# Altium schematic sheet Power.SchDoc
size A4
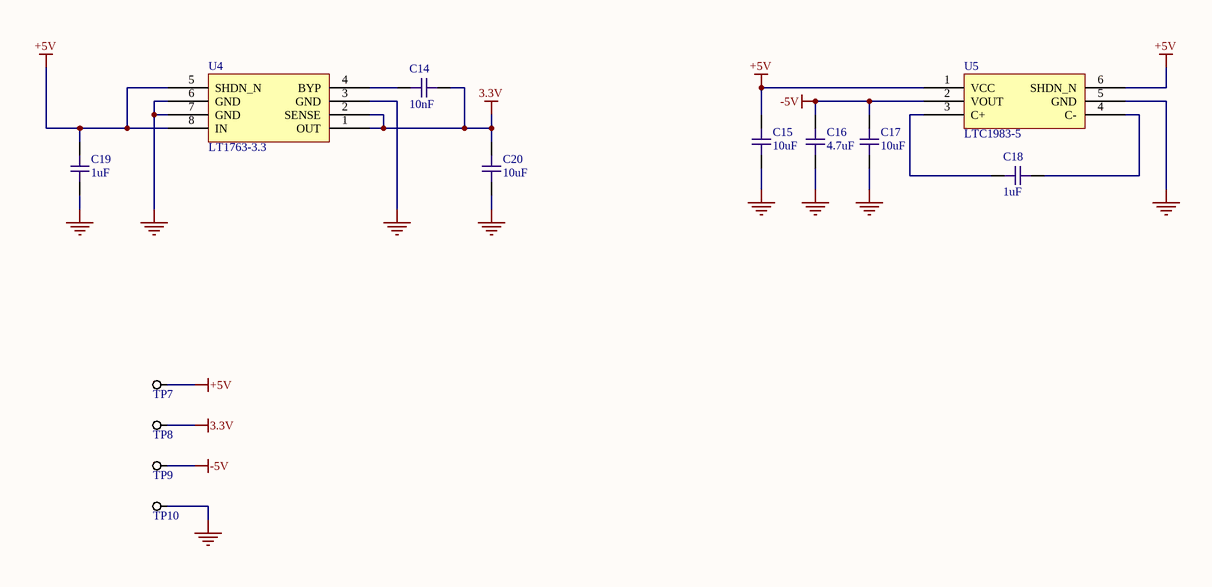
[diagram p0: Power.SchDoc]

## Parts
C14  value 10nF  [C0402-IPC]  (hidden comment: C0402 10nF 16V X7R)
C15  value 10uF  [C0402-HIGH-DENSITY]  (hidden comment: C0402 10uF 10V)
C16  value 4.7uF  [C0603-HIGH-DENSITY]  (hidden comment: 4.7uF, 25V, X5R, 0603)
C17  value 10uF  [C0402-HIGH-DENSITY]  (hidden comment: C0402 10uF 10V)
C18  1uF  [C0603-HIGH-DENSITY]
C19  1uF  [C0603-HIGH-DENSITY]
C20  value 10uF  [C0402-HIGH-DENSITY]  (hidden comment: C0402 10uF 10V)
TP7  Testpoint_TH  [Testpoint_TH]  (value not drawn)
TP8  Testpoint_TH  [Testpoint_TH]  (value not drawn)
TP9  Testpoint_TH  [Testpoint_TH]  (value not drawn)
TP10  Testpoint_TH  [Testpoint_TH]  (value not drawn)
U4  LT1763-3.3  [LT1763-3.3]
U5  LTC1983-5  [LTC1983-5]

## Nets
3.3V: C14.2 C20.2 TP8.1 U4.1(OUT) U4.2(SENSE)
+5V: C15.2 C19.2 TP7.1 U4.5(SHDN_N) U4.8(IN) U5.1(VCC) U5.6(SHDN_N)
-5V: C16.2 C17.2 TP9.1 U5.2(VOUT)
GND: C15.1 C16.1 C17.1 C19.1 C20.1 TP10.1 U4.3(GND) U4.6(GND) U4.7(GND) U5.5(GND)
NetC14_1: C14.1 U4.4(BYP)
NetC18_1: C18.1 U5.3(C+)
NetC18_2: C18.2 U5.4(C-)

## Library data of the parts
C14 = C0402 10nF 16V X7R: Chip Capacitor, 0402, 10nF, 16V, X7R; EIA Code: X5R; Max. Voltage: 16V; Supplier 1: Digi-Key; Supplier Part Number 1: 490-1313-1-ND
C15 C17 C20 = C0402 10uF 10V: Chip Capacitor, 0402, 10uF, 10V, X5R; EIA Code: X5R; Max. Voltage: 10V; Supplier 1: Digi-Key; Supplier Part Number 1: 1276-1450-2-ND
C16 = C0603 4.7uF 25V X5R: Chip Capacitor, 0603, 4.7uF, 25V, X5R; EIA Code: X5R; Max. Voltage: 25V; Supplier 1: Digi-Key; Supplier 2: Mouser; Supplier 3: LCSC; Supplier Part Number 1: 490-7203-1-ND; Supplier Part Number 2: 81-GRM188R61E475KE1D; Supplier Part Number 3: C90057
C18 C19 = 1uF 0603 35V X5R: CAP CER 1UF 35V X5R 0603; Manufacturer: Taiyo Yuden; Manufacturer Part Number: GMK107BJ105MAHT; Tolerance: 20%; Supplier 1: Digi-Key; RoHS: Yes; Category: Ceramic Capacitors; Stock 1: 1779; Pricing 1: 1=0.19000, 10=0.13300, 50=0.07960, 100=0.06730, 500=0.04604, 1000=0.04073 (USD); Mount: Surface Mount; Case/Package: 0603; Min Operating Temperature: -55°C; Max Operating Temperature: 85°C; Packaging: Tape and Reel; Capacitance: 1uF; Voltage Rating: 35V; Ratings: AEC-Q200; RoHS Compliant: Yes; ComponentLink1URL: http://ds.yuden.co.jp/TYCOMPAS/ut/detail.do?productNo=GMK107BJ105MAHT&amp;fileName=GMK107BJ105MAHT_SS&amp;mode=specSheetDownload&src-supplier=Digi-Key; ComponentLink1Description: http://ds.yuden.co.jp/TYCOMPAS/ut/detail.do?productNo=GMK107BJ105MAHT&amp;fileName=GMK107BJ105MAHT_SS&amp;mode=specSheetDownload&src-supplier=Digi-Key; Supplier Part Number 1: 587-6315-1-ND
TP7-TP10 = Testpoint_TH: Through-hole testpoint hook
U4 = LT1763-3.3: LDO Regulator Pos 3.3V 0.5A Automotive 8-Pin SOIC N Tube; Manufacturer: Analog Devices / Linear Technology; Manufacturer Part Number: LT1763CS8-3.3#PBF; Output Current: 500mA; Dropout Voltage: 300mV; Number of Outputs: 1; Max Input Voltage: 20V; Min Input Voltage: 1.8V; Min Current Limit: 520mA; Polarity: Positive; Quiescent Current: 30uA; Reference Voltage: 1.22V; Power Supply Rejection Ratio (PSRR): 65dB; Output Type: Fixed; Supplier 1: Digi-Key; RoHS: Yes; Category: Voltage Regulators - Linear; Stock 1: 7556; Pricing 1: 1=5.20000, 10=4.66700, 25=4.41240, 100=3.82400, 250=3.62784, 500=3.25526, 1000=2.77500 (USD); Case/Package: SOIC; Number of Pins: 8; Min Operating Temperature: -40°C; Max Operating Temperature: 125°C; Package Quantity: 100; Packaging: Rail/Tube; Max Output Current: 500mA; Nominal Output Voltage: 3.3V; Output Voltage: 3.3V; Number of Regulators: 1; Operating Supply Current: 30uA; Series: -; Length: 5mm; Width: 3.988mm; Height: 1.5mm; REACH SVHC: No SVHC; Lead Free: Lead Free; RoHS Compliant: Yes; ComponentLink1URL: https://datasheet.ciiva.com/14150/ef640087-e-14150152.pdf?src-supplier=Distrelec; ComponentLink1Description: https://datasheet.ciiva.com/14150/ef640087-e-14150152.pdf?src-supplier=Distrelec; ComponentLink2URL: https://datasheet.ciiva.com/2041/3903-2041558.pdf?src-supplier=Digi-Key; ComponentLink2Description: https://datasheet.ciiva.com/2041/3903-2041558.pdf?src-supplier=Digi-Key; ComponentLink3URL: https://datasheet.ciiva.com/5698/1599494-5698296.pdf?src-supplier=Farnell; ComponentLink3Description: https://datasheet.ciiva.com/5698/1599494-5698296.pdf?src-supplier=Farnell; Supplier Part Number 1: LT1763CS8-3.3#PBF-ND
U5 = LTC1983-5: IC REG SWTCHD CAP INV -5V SOT23; Manufacturer: Analog Devices / Linear Technology; Manufacturer Part Number: LTC1983ES6-5#TRPBF; Max Supply Voltage: 5.5V; Min Supply Voltage: 2.3V; Output Current: 100mA; Output Voltage: -5.5V; Number of Outputs: 1; Min Input Voltage: 5V; Switching Frequency: 900kHz; Synchronous Rectifier: No; Operating Supply Current: 25uA; Output Type: Fixed; Supplier 1: Digi-Key; RoHS: Yes; Category: Voltage Regulators - Switching; Stock 1: 5862; Pricing 1: 1=4.83000, 10=4.33900, 25=4.10240, 100=3.37290, 250=3.02652, 500=2.91712, 1000=2.42486 (USD); Case/Package: SOT-23-6; Number of Pins: 6; Min Operating Temperature: -40°C; Max Operating Temperature: 85°C; Package Quantity: 2500; Max Output Current: 100mA; Packaging: Tape and Reel; Max Input Voltage: 5.5V; Series: -; Radiation Hardening: No; Lead Free: Lead Free; RoHS Compliant: Yes; ComponentLink1URL: https://datasheet.ciiva.com/15114/getdatasheetpartid-371063-15114160.pdf?src-supplier=Verical; ComponentLink1Description: https://datasheet.ciiva.com/15114/getdatasheetpartid-371063-15114160.pdf?src-supplier=Verical; ComponentLink2URL: https://datasheet.ciiva.com/26898/ltc1983es6-5-trpbf-26898763.pdf?src-supplier=IIIC; ComponentLink2Description: https://datasheet.ciiva.com/26898/ltc1983es6-5-trpbf-26898763.pdf?src-supplier=IIIC; ComponentLink3URL: https://datasheet.ciiva.com/2030/2135-2030773.pdf?src-supplier=Digi-Key; ComponentLink3Description: https://datasheet.ciiva.com/2030/2135-2030773.pdf?src-supplier=Digi-Key; Supplier Part Number 1: LTC1983ES6-5#TRPBFCT-ND